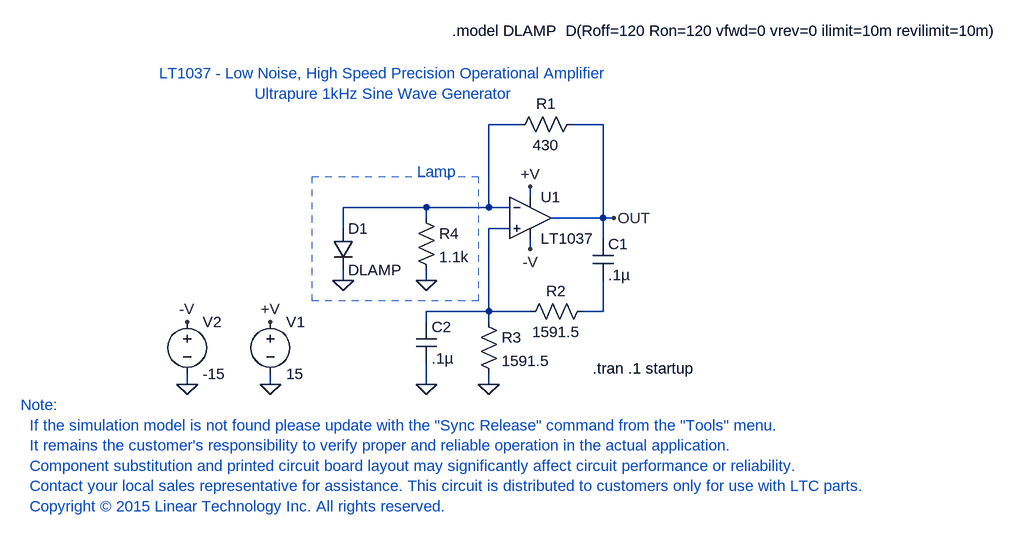
[diagram p0: schematic LT1037_TA01_BobX.asc]
LT1037_TA01_BobX.asc, the LTspice schematic file:
Version 4
SHEET 1 1184 964
WIRE 176 96 128 96
WIRE 304 96 256 96
WIRE 192 208 192 192
WIRE 32 224 -96 224
WIRE 128 224 128 96
WIRE 128 224 32 224
WIRE 160 224 128 224
WIRE 32 240 32 224
WIRE 304 240 304 96
WIRE 304 240 224 240
WIRE 320 240 304 240
WIRE -96 256 -96 224
WIRE 160 256 128 256
WIRE 304 272 304 240
WIRE 192 288 192 272
WIRE -96 336 -96 320
WIRE 32 336 32 320
WIRE 128 384 128 256
WIRE 128 384 32 384
WIRE 192 384 128 384
WIRE 304 384 304 336
WIRE 304 384 272 384
WIRE 32 400 32 384
WIRE 128 400 128 384
WIRE -336 496 -336 480
WIRE -208 496 -208 480
WIRE 32 496 32 464
WIRE 128 496 128 480
FLAG -208 496 0
FLAG 192 192 +V
FLAG -208 400 +V
FLAG 192 288 -V
FLAG -336 496 0
FLAG -336 400 -V
FLAG 320 240 OUT
FLAG 32 496 0
FLAG 128 496 0
FLAG 32 336 0
FLAG -96 336 0
SYMBOL voltage -208 384 R0
SYMATTR InstName V1
SYMATTR Value 15
SYMBOL voltage -336 384 R0
SYMATTR InstName V2
SYMATTR Value -15
SYMBOL res 272 80 R90
WINDOW 0 0 56 VBottom 2
WINDOW 3 32 56 VTop 2
SYMATTR InstName R1
SYMATTR Value 430
SYMBOL opamps\\LT1037 192 176 R0
SYMATTR InstName U1
SYMBOL cap 288 272 R0
SYMATTR InstName C1
SYMATTR Value .1µ
SYMBOL res 288 368 R90
WINDOW 0 0 56 VBottom 2
WINDOW 3 32 56 VTop 2
SYMATTR InstName R2
SYMATTR Value 1591.5
SYMBOL cap 16 400 R0
SYMATTR InstName C2
SYMATTR Value .1µ
SYMBOL res 112 384 R0
SYMATTR InstName R3
SYMATTR Value 1591.5
SYMBOL res 16 224 R0
SYMATTR InstName R4
SYMATTR Value 1.1k
SYMBOL diode -112 256 R0
SYMATTR InstName D1
SYMATTR Value DLAMP
TEXT 288 472 Left 2 !.tran .1 startup
TEXT -32 64 Bottom 2 ;LT1037 - Low Noise, High Speed Precision Operational Amplifier\nUltrapure 1kHz Sine Wave Generator
TEXT -592 528 Left 2 ;Note:\n  If the simulation model is not found please update with the "Sync Release" command from the "Tools" menu.\n  It remains the customer's responsibility to verify proper and reliable operation in the actual application.\n  Component substitution and printed circuit board layout may significantly affect circuit performance or reliability.\n  Contact your local sales representative for assistance. This circuit is distributed to customers only for use with LTC parts.\n  Copyright © 2015 Linear Technology Inc. All rights reserved.
TEXT 48 184 Bottom 2 ;Lamp
TEXT 72 -48 Left 2 !.model DLAMP  D(Roff=120 Ron=120 vfwd=0 vrev=0 ilimit=10m revilimit=10m)
RECTANGLE Normal 112 368 -144 176 2

The netlist it stands for:
* LT1037_TA01_BobX.asc
V1 +V 0 15
V2 -V 0 -15
R1 OUT N001 430
XU1 N002 N001 +V -V OUT LT1037  ; pins In+ In- V+ V- OUT
C1 OUT N003 .1µ
R2 N003 N002 1591.5
C2 N002 0 .1µ
R3 N002 0 1591.5
R4 N001 0 1.1k
D1 N001 0 DLAMP
.model D D
.lib standard.dio
.tran .1 startup
* LT1037 - Low Noise, High Speed Precision Operational Amplifier
* Ultrapure 1kHz Sine Wave Generator
* Note:
*   If the simulation model is not found please update with the "Sync Release" command from the "Tools" menu.
*   It remains the customer's responsibility to verify proper and reliable operation in the actual application.
*   Component substitution and printed circuit board layout may significantly affect circuit performance or reliability.
*   Contact your local sales representative for assistance. This circuit is distributed to customers only for use with LTC parts.
*   Copyright © 2015 Linear Technology Inc. All rights reserved.
* Lamp
.model DLAMP  D(Roff=120 Ron=120 vfwd=0 vrev=0 ilimit=10m revilimit=10m)
.backanno
.end